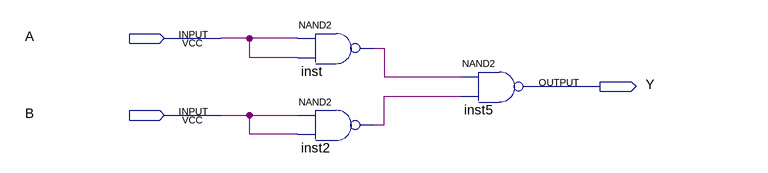
[diagram p0: schematic sheet]
// Quartus schematic fuhemen.bdf as structural Verilog: 3 symbols, 3 pins
module fuhemen (
  input  A,
  input  B,
  output Y
);

  wire inst2_out, inst_out;

  nand inst (inst_out, A, A);
  nand inst2 (inst2_out, B, B);
  nand inst5 (Y, inst_out, inst2_out);
endmodule
